# Altium schematic sheet V_16.SchDoc
size A4
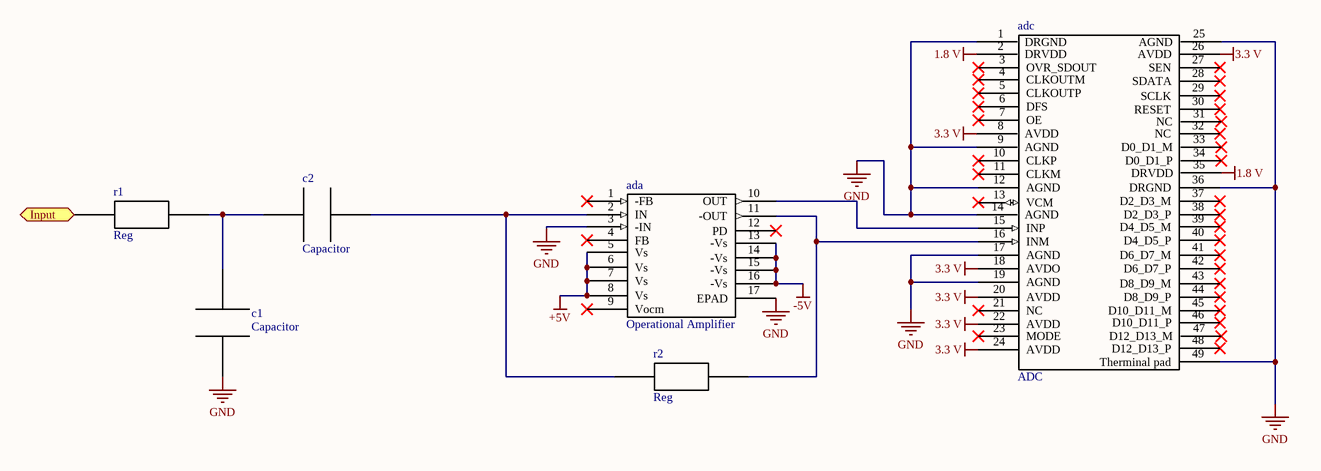
[diagram p0: V_16.SchDoc]

## Parts
ada  Operational Amplifier  [ADA4932-1]
adc  ADC  [ADS61b49]
c1  Capacitor  [Ñ]
c2  Capacitor  [Ñ]
r1  Reg  [R_0.0085]
r2  Reg  [R_0.0085]

## Ports
Input

## Nets
1.8 V: adc.2(DRVDD) adc.35(DRVDD)
3.3 V: adc.8(AVDD) adc.18(AVDO) adc.20(AVDD) adc.22(AVDD) adc.24(AVDD) adc.26(AVDD)
+5V: ada.5(Vs) ada.6(Vs) ada.7(Vs) ada.8(Vs)
-5V: ada.13(-Vs) ada.14(-Vs) ada.15(-Vs) ada.16(-Vs)
GND: ada.3(-IN) ada.17(EPAD) adc.1(DRGND) adc.9(AGND) adc.12(AGND) adc.14(AGND) adc.17(AGND) adc.19(AGND) adc.25(AGND) adc.36(DRGND) adc.49(Therminal_pad) c1.1
Input: r1.1 ; port Input
Netada_2: ada.2(IN) c2.2 r2.1
Netada_10: ada.10(OUT) adc.15(INP)
Netada_11: ada.11(-OUT) adc.16(INM) r2.2
Netc1_2: c1.2 c2.1 r1.2

Not connected (* = marked no-connect by the designer): ada 1(-FB)* 4(FB)* 9(Vocm)* 12(PD)*; adc 3(OVR_SDOUT)* 4(CLKOUTM)* 5(CLKOUTP)* 6(DFS)* 7(OE)* 10(CLKP)* 11(CLKM)* 13(VCM)* 21(NC)* 23(MODE)* 27(SEN)* 28(SDATA)* 29(SCLK)* 30(RESET)* 31(NC)* 32(NC)* 33(D0_D1_M)* 34(D0_D1_P)* 37(D2_D3_M)* 38(D2_D3_P)* 39(D4_D5_M)* 40(D4_D5_P)* 41(D6_D7_M)* 42(D6_D7_P)* 43(D8_D9_M)* 44(D8_D9_P)* 45(D10_D11_M)* 46(D10_D11_P)* 47(D12_D13_M)* 48(D12_D13_P)*